# EAGLE design usb2classic (EAGLE 6.6.0)
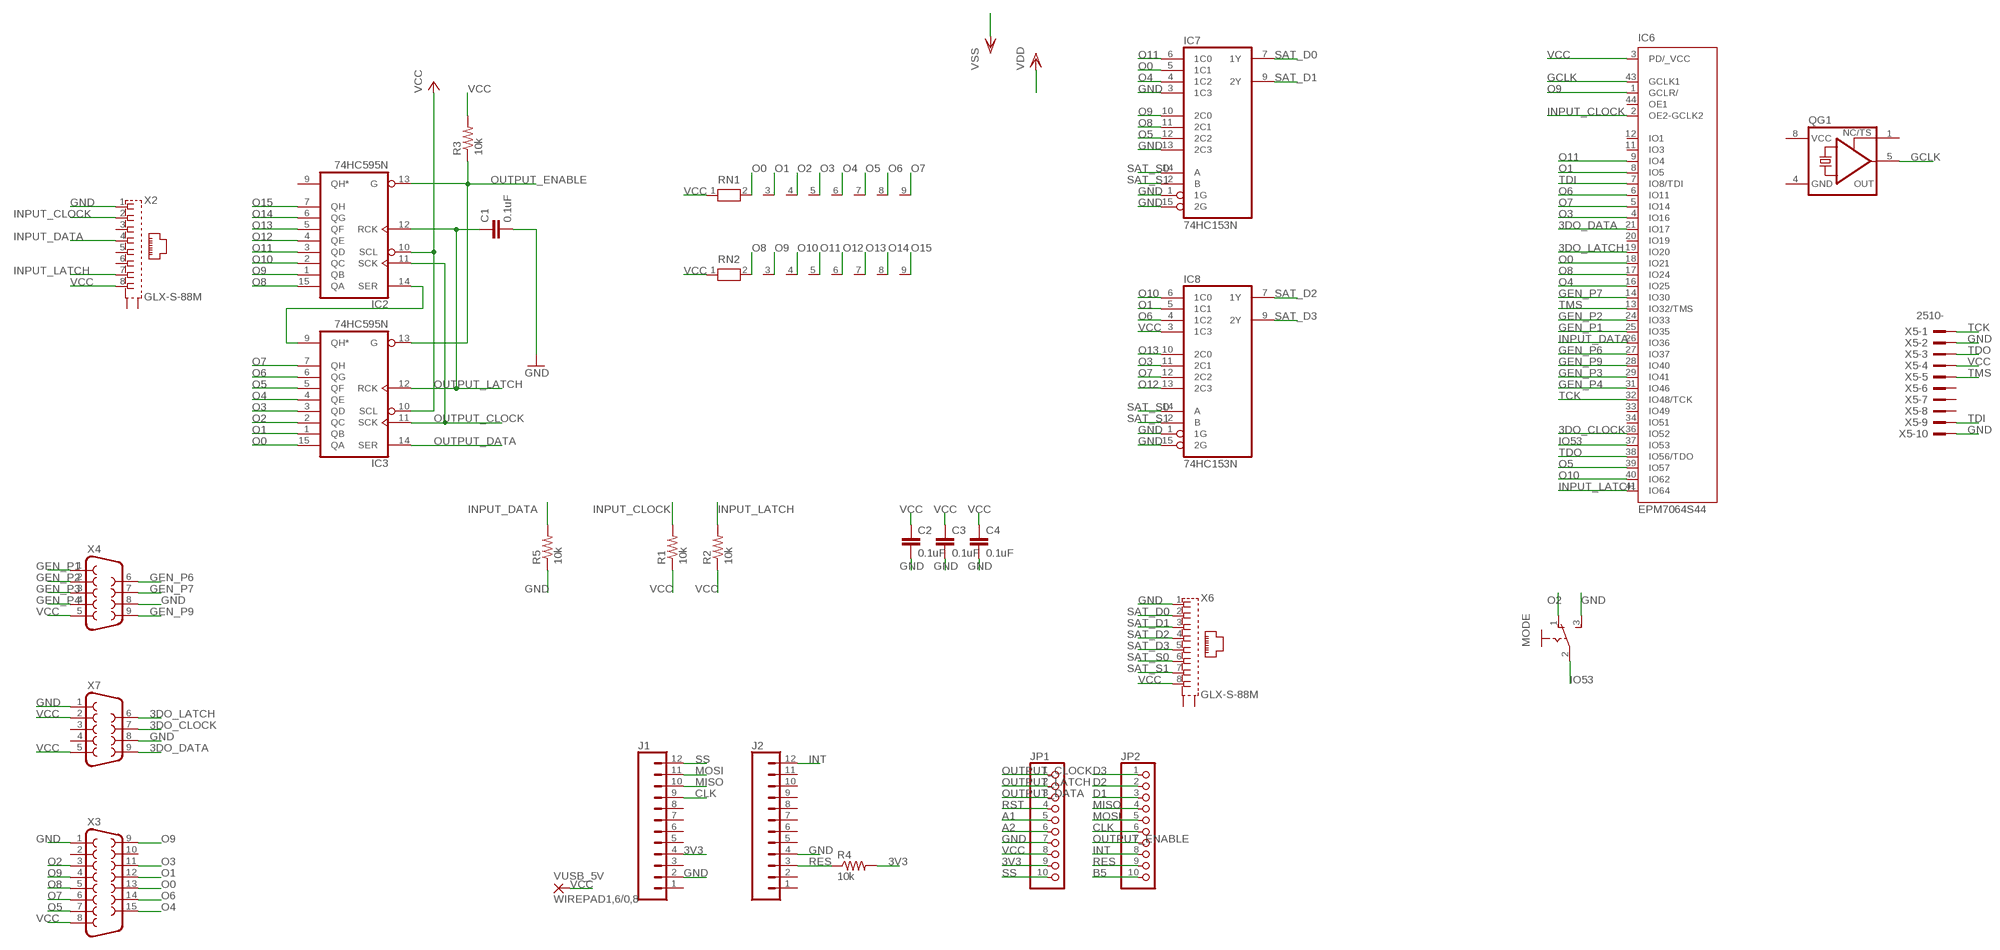
[diagram p0: schematic, sheet 1]

## Parts
C1  0.1uF  C-EU050-024X044  [C050-024X044]
C2  0.1uF  C-EU050-024X044  [C050-024X044]
C3  0.1uF  C-EU050-024X044  [C050-024X044]
C4  0.1uF  C-EU050-024X044  [C050-024X044]
IC2  74HC595N  [DIL16]
IC3  74HC595N  [DIL16]
IC6  EPM7064S44  [PLCC-S44]
IC7  74HC153N  [DIL16]
IC8  74HC153N  [DIL16]
J1  CONN_12  [1X12]
J2  CONN_12  [1X12]
JP1  PINHD-1X10  [1X10]
JP2  PINHD-1X10  [1X10]
MODE  CHAVE  [CHAVE]
QG1  XO-8  [DIL08S]
R1  10k  R-US_0207/10  [0207/10]
R2  10k  R-US_0207/10  [0207/10]
R3  10k  R-US_0207/10  [0207/10]
R4  10k  R-US_0207/10  [0207/10]
R5  10k  R-US_0207/10  [0207/10]
RN1  RN08  [RN-9]
RN2  RN08  [RN-9]
VUSB_5V  WIREPAD1,6/0,8  [1,6/0,8]
X2  GLX-S-88M  [GLX-S-88M]
X3  F15HP  [F15HP]
X4  F09HP  [F09HP]
X5  2510-  [PAK100/2500-10]
X6  GLX-S-88M  [GLX-S-88M]
X7  F09HP  [F09HP]

## Nets
3DO_CLOCK: IC6.36(IO52) X7.7
3DO_DATA: IC6.21(IO17) X7.9
3DO_LATCH: IC6.19(IO20) X7.6
3V3: J1.4 JP1.9 R4.2
A1: JP1.5
A2: JP1.6
B5: JP2.10
CLK: J1.9 JP2.6
D1: JP2.3
D2: JP2.2
D3: JP2.1
GCLK: IC6.43(GCLK1) QG1.5(OUT)
GEN_P1: IC6.25(IO35) X4.1
GEN_P2: IC6.24(IO33) X4.2
GEN_P3: IC6.29(IO41) X4.3
GEN_P4: IC6.31(IO46) X4.4
GEN_P6: IC6.27(IO37) X4.6
GEN_P7: IC6.14(IO30) X4.7
GEN_P9: IC6.28(IO40) X4.9
GND: C1.2 C2.2 C3.2 C4.2 IC7.1(1G) IC7.3(1C3) IC7.13(2C3) IC7.15(2G) IC8.1(1G) IC8.15(2G) J1.2 J2.4 JP1.7 MODE.3(S) R5.1 X2.1 X3.1 X4.8 X5.2 X5.10 X6.1 X7.1 X7.8 ; supply symbol labelled VSS
INPUT_CLOCK: IC6.2(OE2-GCLK2) R1.2 X2.2
INPUT_DATA: IC6.26(IO36) R5.2 X2.4
INPUT_LATCH: IC6.41(IO64) R2.2 X2.7
INT: J2.12 JP2.8
IO53: IC6.37(IO53) MODE.2(P)
MISO: J1.10 JP2.4
MOSI: J1.11 JP2.5
N$1: IC2.14(SER) IC3.9(QH*)
O0: IC3.15(QA) IC6.18(IO21) IC7.5(1C1) RN1.2 X3.13
O1: IC3.1(QB) IC6.8(IO5) IC8.5(1C1) RN1.3 X3.12
O2: IC3.2(QC) MODE.1(O) RN1.4 X3.3
O3: IC3.3(QD) IC6.4(IO16) IC8.11(2C1) RN1.5 X3.11
O4: IC3.4(QE) IC6.16(IO25) IC7.4(1C2) RN1.6 X3.15
O5: IC3.5(QF) IC6.39(IO57) IC7.12(2C2) RN1.7 X3.7
O6: IC3.6(QG) IC6.6(IO11) IC8.4(1C2) RN1.8 X3.14
O7: IC3.7(QH) IC6.5(IO14) IC8.12(2C2) RN1.9 X3.6
O8: IC2.15(QA) IC6.17(IO24) IC7.11(2C1) RN2.2 X3.5
O9: IC2.1(QB) IC6.1(GCLR/) IC7.10(2C0) RN2.3 X3.4 X3.9
O10: IC2.2(QC) IC6.40(IO62) IC8.6(1C0) RN2.4
O11: IC2.3(QD) IC6.9(IO4) IC7.6(1C0) RN2.5
O12: IC2.4(QE) IC8.13(2C3) RN2.6
O13: IC2.5(QF) IC8.10(2C0) RN2.7
O14: IC2.6(QG) RN2.8
O15: IC2.7(QH) RN2.9
OUTPUT_CLOCK: IC2.11(SCK) IC3.11(SCK) JP1.1
OUTPUT_DATA: IC3.14(SER) JP1.3
OUTPUT_ENABLE: IC2.13(G) IC3.13(G) JP2.7 R3.1
OUTPUT_LATCH: C1.1 IC2.12(RCK) IC3.12(RCK) JP1.2
RES: J2.3 JP2.9 R4.1
RST: JP1.4
SAT_D0: IC7.7(1Y) X6.2
SAT_D1: IC7.9(2Y) X6.3
SAT_D2: IC8.7(1Y) X6.4
SAT_D3: IC8.9(2Y) X6.5
SAT_S0: IC7.14(A) IC8.14(A) X6.6
SAT_S1: IC7.2(B) IC8.2(B) X6.7
SS: J1.12 JP1.10
TCK: IC6.32(IO48/TCK) X5.1
TDI: IC6.7(IO8/TDI) X5.9
TDO: IC6.38(IO56/TDO) X5.3
TMS: IC6.13(IO32/TMS) X5.5
VCC: C2.1 C3.1 C4.1 IC2.10(SCL) IC3.10(SCL) IC6.3(PD/_VCC) IC8.3(1C3) JP1.8 R1.1 R2.1 R3.2 RN1.1 RN2.1 VUSB_5V.1(P) X2.8 X3.8 X4.5 X5.4 X6.8 X7.2 X7.5 ; supply symbol labelled VDD
Unconnected: IC2.9(QH*) IC6.11(IO3) IC6.12(IO1) IC6.20(IO19) IC6.33(IO49) IC6.34(IO51) IC6.44(OE1) J1.1 J1.3 J1.5 J1.6 J1.7 J1.8 J2.1 J2.2 J2.5 J2.6 J2.7 J2.8 J2.9 J2.10 J2.11 QG1.1(TS) X2.3 X2.5 X2.6 X2.S1 X2.S2 X3.2 X3.10 X5.6 X5.7 X5.8 X6.S1 X6.S2 X7.3 X7.4

## Power pins joined to a net without a drawn wire
GND: IC2.8(GND) IC3.8(GND) IC6.10(GND) IC6.22(GND) IC6.30(GND) IC6.42(GND) IC7.8(GND) IC8.8(GND) QG1.4(GND)
VCC: IC2.16(VCC) IC3.16(VCC) IC6.15(VCC) IC6.23(VCC) IC6.35(VCC) IC7.16(VCC) IC8.16(VCC) QG1.8(VCC)

## Library data of the parts
C1-C4 = rcl:C-EU: CAPACITOR, European symbol
IC2 IC3 = 74xx-eu:74*595: 8-bit SHIFT REGISTER, output latch
IC6 = altera:EPM7064: EPM7064 MAX 7000 family; MPN: EPM7064SLC44-10N; OC_FARNELL: 1549449; OC_NEWARK: 51R0526
IC7 IC8 = 74xx-eu:74*153: Dual 4-line to 1-line data SELECTOR/MULTIPLEXER
J1 J2 = SparkFun-Connectors:CONN_12: Multi connection point. Often used as Generic Header-pin footprint for 0.1 inch spaced/style header connections On any of the 0.1 inch spaced packages, you can populate with these: Break Away Headers - Straight <https://www.sparkfun.com/products/116> (PRT-00116) Break Away Male Headers - Right Angle <https://www.sparkfun.com/products/553> (PRT-00553) Female Headers <https://www.sparkfun.com/products/115> (PRT-00115) Break Away Headers - Machine Pin <https://www.sparkfun.com/products/117> (PRT-00117) Break Away Female Headers - Swiss Machine Pin <https://www.sparkfun.com/products/743> (PRT-00743) For SCREWTERMINALS and SPRING TERMINALS visit here: Screw Terimnals on SparkFun.com <https://www.sparkfun.com/search/results?term=Screw+Terminals> (5mm/3.5mm/2.54mm spacing) This device is also useful as a general connection point to wire up your design to another part of your project. Our various solder wires solder well into these plated through hole pads. Hook-Up Wire - Assortment (Stranded, 22 AWG) <https://www.sparkfun.com/products/11375> (PRT-11375) Hook-Up Wire - Assortment (Solid Core, 22 AWG) <https://www.sparkfun.com/products/11367> (PRT-11367) View the entire wire category on our website here <https://www.sparkfun.com/categories/141> Special notes: Molex polarized connector foot print use with SKU : PRT-08231 with associated crimp pins and housings. 1MM SMD Version SKU: PRT-10208 NOTES ON THE VARIANTS LOCK and LOCK_LONGPADS... This footprint was designed to help hold the alignment of a through-hole component (i.e. 6-pin header) while soldering it into place. You may notice that each hole has been shifted either up or down by 0.005 of an inch from it's more standard position (which is a perfectly straight line). This slight alteration caused the pins (the squares in the middle) to touch the edges of the holes. Because they are alternating, it causes a "brace" to hold the component in place. 0.005 has proven to be the perfect amount of "off-center" position when using our standard breakaway headers. Although looks a little odd when you look at the bare footprint, once you have a header in there, the alteration is very hard to notice. Also,if you push a header all the way into place, it is covered up entirely on the bottom side.
JP1 JP2 = pinhead:PINHD-1X10: PIN HEADER
MODE = switch-fef:CHAVE: chave Verificar
QG1 = crystal:XO-: CRYSTAL; OC_FARNELL: unknown; OC_NEWARK: unknown
R1-R5 = resistor:R-US_: RESISTOR, American symbol
RN1 RN2 = resistor-net:RN08: RESISTOR NETWORK; OC_FARNELL: unknown; OC_NEWARK: unknown
VUSB_5V = wirepad:WIREPAD: Wire PAD connect wire on PCB
X2 X6 = con-kycon:GLX-S-88M: Mod. Jack, Right Angle, 8 posiotion, 8 contatcs RJ45 Source: GLX-S-88M.pdf; OC_FARNELL: unknown; OC_NEWARK: unknown
X3 = con-subd:F15: SUB-D; OC_FARNELL: unknown; OC_NEWARK: unknown
X4 X7 = con-subd:F09: SUB-D; OC_FARNELL: unknown; OC_NEWARK: unknown
X5 = con-3m:2510-: 3M (TM) Pak 100 4-Wall Header Source: 3M; MF: 3M; MPN: 2510-6002UB; OC_FARNELL: 9838244; OC_NEWARK: 46F4725

## Board
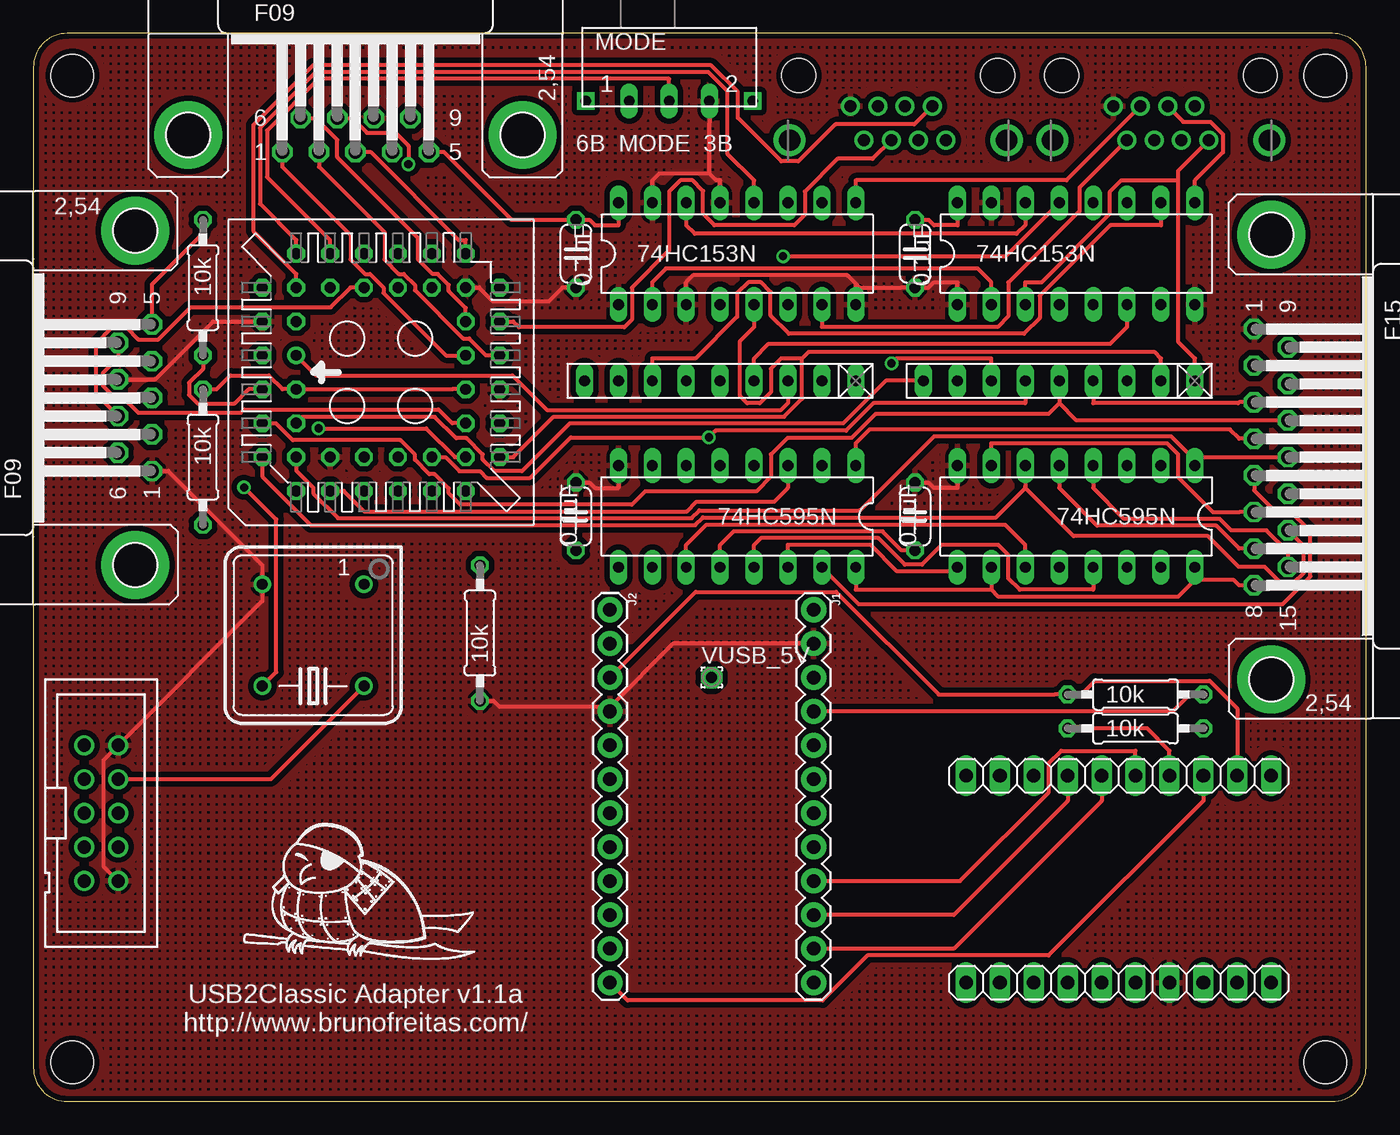
[diagram p1: board, top side]
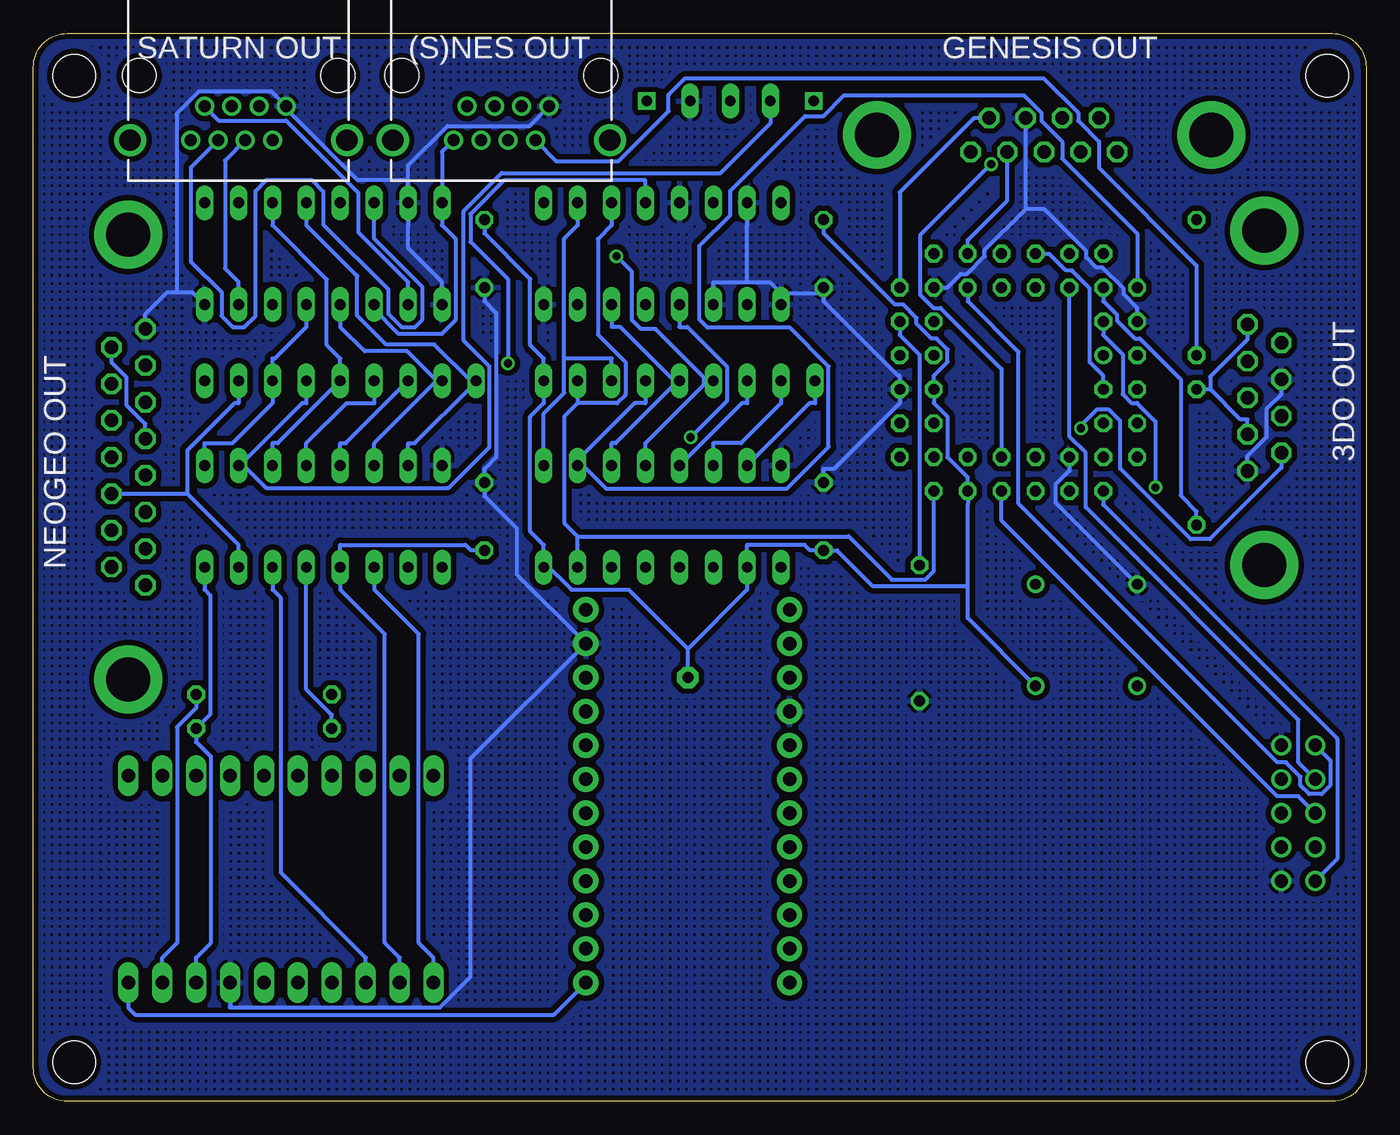
[diagram p2: board, bottom side, seen from below]

Size 99.82 x 80 mm. Coordinates in mm from the lower left corner, seen from the top.
Outline: 2.54,0 97.28,0 arc90 99.82,2.54 99.82,77.46 arc90 97.28,80 2.54,80 arc90 0,77.46 0,2.54 arc90 2.54,0
Copper layers (1*16): Top 0.035mm / dielectric 1.5mm / Bottom 0.035mm
Design rules "SeeedStudio_2layer_DRU_no_angle_20140221": minimum track width 6mil, minimum drill 12mil, track to track 6mil, track to pad 6mil, pad to pad 6mil, via to via 6mil, smd to smd 0mil, copper to edge 10mil, drill to drill 10mil, minimum pad ring 10mil, minimum via ring 6mil, stop-mask expansion 2mil, vias tented up to drill 100mil, thermal gap 10mil
Holes 3.2 mm at 2.92,2.92 96.77,2.92 2.92,76.83 96.77,76.83

### Footprints (pad centres in the part's own frame; a part is rotated, then mirrored left to right if it is on the bottom)
C050-024X044 = drill 0.813 octagon: 1 -2.54,0; 2 2.54,0
DIL16 = drill 0.813 long: 1 -8.89,-3.81; 2 -6.35,-3.81; 3 -3.81,-3.81; 4 -1.27,-3.81; 5 1.27,-3.81; 6 3.81,-3.81; 7 6.35,-3.81; 8 8.89,-3.81; 9 8.89,3.81; 10 6.35,3.81; 11 3.81,3.81; 12 1.27,3.81; 13 -1.27,3.81; 14 -3.81,3.81; 15 -6.35,3.81; 16 -8.89,3.81
PLCC-S44 = drill 0.813: 1 1.27,6.35 | drill 0.813 octagon: 2 -1.27,8.89; 3 -1.27,6.35; 4 -3.81,8.89; 5 -3.81,6.35; 6 -6.35,8.89; 7 -8.89,6.35; 8 -6.35,6.35; 9 -8.89,3.81; 10 -6.35,3.81; 11 -8.89,1.27; 12 -6.35,1.27; 13 -8.89,-1.27; 14 -6.35,-1.27; 15 -8.89,-3.81; 16 -6.35,-3.81; 17 -8.89,-6.35; 18 -6.35,-8.89; 19 -6.35,-6.35; 20 -3.81,-8.89; 21 -3.81,-6.35; 22 -1.27,-8.89; 23 -1.27,-6.35; 24 1.27,-8.89; 25 1.27,-6.35; 26 3.81,-8.89; 27 3.81,-6.35; 28 6.35,-8.89; 29 8.89,-6.35; 30 6.35,-6.35; 31 8.89,-3.81; 32 6.35,-3.81; 33 8.89,-1.27; 34 6.35,-1.27; 35 8.89,1.27; 36 6.35,1.27; 37 8.89,3.81; 38 6.35,3.81; 39 8.89,6.35; 40 6.35,8.89; 41 6.35,6.35; 42 3.81,8.89; 43 3.81,6.35; 44 1.27,8.89
1X12 = drill 1.016 pad 1.88: 1 0,0; 2 2.54,0; 3 5.08,0; 4 7.62,0; 5 10.16,0; 6 12.7,0; 7 15.24,0; 8 17.78,0; 9 20.32,0; 10 22.86,0; 11 25.4,0; 12 27.94,0
1X10 = drill 1.016 long: 1 -11.43,0; 2 -8.89,0; 3 -6.35,0; 4 -3.81,0; 5 -1.27,0; 6 1.27,0; 7 3.81,0; 8 6.35,0; 9 8.89,0; 10 11.43,0
CHAVE = drill 0.8 long: 1 -3,0; 2 0,0; 3 3,0 | drill 0.8 square: P$1 -6.25,0; P$2 6.25,0
DIL08S = drill 0.813: 1 -3.81,-3.81; 4 3.81,-3.81; 5 3.81,3.81; 8 -3.81,3.81
0207/10 = drill 0.813 octagon: 1 -5.08,0; 2 5.08,0
RN-9 = drill 0.813 long: 1 -10.16,0; 2 -7.62,0; 3 -5.08,0; 4 -2.54,0; 5 0,0; 6 2.54,0; 7 5.08,0; 8 7.62,0; 9 10.16,0
1,6/0,8 = drill 0.813 pad 1.6 octagon: 1 0,0
GLX-S-88M = drill 0.9 pad 1.422: 1 -3.57,-2.3; 2 -2.55,-4.84; 3 -1.53,-2.3; 4 -0.51,-4.84; 5 0.51,-2.3; 6 1.53,-4.84; 7 2.55,-2.3; 8 3.57,-4.84 | drill 1.6 pad 2.184: S1 -8.125,-4.84; S2 8.125,-4.84 | hole 2.55: -7.44,0; 7.44,0
F15HP = drill 1.016 octagon: 1 -9.601,-1.27; 2 -6.858,-1.27; 3 -4.115,-1.27; 4 -1.372,-1.27; 5 1.372,-1.27; 6 4.115,-1.27; 7 6.858,-1.27; 8 9.601,-1.27; 9 -8.23,1.27; 10 -5.486,1.27; 11 -2.743,1.27; 12 0,1.27; 13 2.743,1.27; 14 5.486,1.27; 15 8.23,1.27 | drill 3.302 pad 5.08: G1 -16.662,0; G2 16.662,0
F09HP = drill 1.016 octagon: 1 -5.486,-1.27; 2 -2.743,-1.27; 3 0,-1.27; 4 2.743,-1.27; 5 5.486,-1.27; 6 -4.115,1.27; 7 -1.372,1.27; 8 1.372,1.27; 9 4.115,1.27 | drill 3.302 pad 5.08: G1 -12.522,0; G2 12.522,0
PAK100/2500-10 = drill 1 pad 1.422: 1 -5.08,-1.27; 2 -5.08,1.27; 3 -2.54,-1.27; 4 -2.54,1.27; 5 0,-1.27; 6 0,1.27; 7 2.54,-1.27; 8 2.54,1.27; 9 5.08,-1.27; 10 5.08,1.27

### Placement (x,y rotation side)
C1  66.04,43.81 90 top
C2  40.64,43.81 90 top
C3  40.64,63.5 270 top
C4  66.04,63.5 270 top
IC2  52.7,43.81 180 top
IC3  78.11,43.81 180 top
IC6  26.04,54.61 90 top
IC7  52.7,63.5 0 top
IC8  78.11,63.5 0 top
J1  58.44,36.83 270 top
J2  43.18,36.83 270 top
JP1  81.28,8.89 0 top
JP2  81.28,24.39 0 top
MODE  47.62,74.93 0 top
QG1  20.95,34.92 180 top
R1  12.7,60.96 270 top
R2  12.7,48.26 270 top
R3  82.55,27.94 0 top
R4  82.55,30.48 0 top
R5  33.45,35.08 90 top
RN1  76.83,53.98 180 top
RN2  51.44,53.98 180 top
VUSB_5V  50.8,31.75 0 top
X2  64.77,76.83 0 top
X3  92.71,48.26 270 top
X4  24.13,72.39 0 top
X5  5.08,21.59 270 top
X6  84.45,76.83 0 top
X7  7.62,52.7 90 top

### Tracks (layer width: path | path; a pad name or v marks a point on that pad's centre or on a via)
3DO_CLOCK
  Top 0.305: IC6.36 23.75,60.96 22.28,59.49 11.78,59.49 9.36,57.07 7.85,57.07 6.94,57.99 5.9,57.99 4.69,56.78 4.69,52.99 X7.7
3DO_DATA
  Top 0.305: IC6.21 31.37,50.8 30.34,51.83 15.79,51.83 15.54,51.58 7.86,51.58 6.56,52.88 5.93,52.88 5.2,53.61 5.2,54.55 6.35,55.7 X7.9
3DO_LATCH  (via drill 0.61 pad 1.02)
  Top 0.305: v21.36,50.41 29.43,50.41 31.58,48.26 IC6.19
  Bottom 0.305: v21.36,50.41 21.36,50.63 20.18,51.82 19.26,51.82 18.41,50.98 18.41,47.4 13.14,42.12 11.7,42.12 6.35,47.47 X7.6
3V3
  Top 0.305: R4.2 86.61,30.48 85.34,29.21 J1.4
  Bottom 0.305: JP1.9 90.17,10.77 89.05,11.89 89.05,28.04 87.63,29.46 R4.2
CLK
  Top 0.305: JP2.6 82.55,26.27 76.98,26.27 76.05,25.34 76.05,23.16 69.4,16.51 J1.9
GCLK  (via drill 0.61 pad 1.02)
  Top 0.305: QG1.5 18.18,32.15 18.18,43.59 v15.78,45.99
  Bottom 0.305: v15.78,45.99 15.78,50.94 17.16,52.32 17.59,52.32 18.23,52.97 18.23,55.95 19.68,57.4 IC6.43
GEN_P1
  Top 0.305: X4.1 18.64,70 23.75,64.9 23.75,63.06 24.83,61.98 25.21,61.98 26.22,60.97 26.22,60.56 30.9,55.88 IC6.25
GEN_P2
  Top 0.305: X4.2 21.39,70 26.29,65.1 26.29,63.06 27.37,61.98 27.75,61.98 28.57,61.15 28.57,60.77 32.19,57.15 32.64,57.15 33.91,55.88 IC6.24
GEN_P3
  Top 0.305: IC6.29 32.38,64.52 31.85,64.52 25.25,71.12 X4.3
GEN_P4
  Bottom 0.305: X4.4 26.87,67.49 29.84,64.52 IC6.31
GEN_P6
  Top 0.305: IC6.27 32.38,59.44 31.11,60.71 31.11,61.15 30.29,61.98 29.91,61.98 28.83,63.06 28.83,64.67 22.76,70.74 22.76,72.03 21.13,73.66 X4.6
GEN_P7  (via drill 0.61 pad 1.02)
  Top 0.305: v28.09,70.2 28.09,71.57 27.11,72.54 24.99,72.54 23.88,73.66 X4.7
  Bottom 0.305: v28.09,70.2 33.41,64.87 33.41,60.44 32.42,59.44 31.88,59.44 27.3,54.86 IC6.14
GEN_P9
  Bottom 0.305: X4.9 29.36,73.66 34.92,68.1 IC6.28
GND
  Top 0.305: X7.1 10.1,47.22 17.14,40.17 QG1.4 17.14,37.47 X5.2 5.24,25.56 5.24,17.62 X5.10 | 43.18,29.56 34.9,29.56 34.47,30 R5.1 | J1.2 47.91,34.29 43.18,29.56 | 43.18,29.56 J2.4 | X7.8 9.12,54.08 13.46,58.42 IC6.42 | 61.59,61.24 60.96,61.88 49.4,61.88 48.9,61.37 IC7.3 | 50.62,69.5 46.86,69.5 46.35,68.99 IC7.15 | 50.62,69.5 50.62,73.27 MODE.3 | 50.62,69.5 51.13,68.99 51.44,68.99 IC7.13 | 61.59,61.24 61.87,60.96 65.02,60.96 C4.2 67.06,60.96 67.46,61.37 69.22,61.37 IC8.1 | C2.2 41.66,46.35 42.06,45.95 43.81,45.95 IC2.8 | IC7.8 61.59,61.24 | C1.2 67.06,46.35 67.46,45.95 69.22,45.95 IC3.8 | C3.2 39.62,60.96 38.59,59.92 34.44,59.92 33.4,60.96 IC6.30
  Bottom 0.305: C4.2 66.04,59.94 65.15,59.05 65.15,48.26 66.04,47.37 C1.2 66.04,45.34 63.59,42.89 63.59,39.44 J1.2 67.1,25.63 67.1,9.3 69.39,7.01 85.09,7.01 JP1.7 | IC6.30 31.37,60.96 30.35,61.98 29.91,61.98 28.57,63.31 28.57,63.76 25.5,66.83 | 25.5,66.83 X4.8 | 25.5,66.83 24.11,66.83 20.95,63.68 20.95,63.23 20.19,62.47 19.75,62.47 18.16,60.88 18.16,60.45 17.14,59.44 IC6.42 | 89.1,60.6 87.91,60.6 IC8.8 | 89.1,60.6 89.81,60.6 91.44,58.98 X3.1 | 89.1,60.6 89.1,73.97 87.43,75.64 81.99,75.64 X6.1 80.89,74.35 75.52,68.99 71.75,68.99 | QG1.4 23.24,44.83 23.24,46.23 22.23,47.24 IC6.10 | X7.1 8.89,48.34 7.47,49.76 7.47,51.84 6.35,52.96 X7.8 | 46.35,61.37 44.65,61.37 43.81,60.53 | 46.35,61.37 48.9,61.37 IC7.3 | 46.35,61.37 46.35,65.63 IC7.15 | IC7.1 43.81,60.53 | 40.64,60.53 40.64,59.94 35.05,54.36 34.92,54.36 IC6.22 34.92,52.32 39.88,47.37 40.64,47.37 C2.2 | C3.2 40.64,60.53 | 43.81,60.53 40.64,60.53 | 71.75,68.99 71.75,70.11 68.81,73.06 62.67,73.06 X2.1 | 71.75,68.99 IC8.15 71.75,65.63 71.75,63.91 69.22,61.37 IC8.1
  pour Bottom (isolate 0.406, hatched): 0,80.29 99.87,80.29 99.87,0 0,0
  pour Top (isolate 0.406, hatched): 0,80.11 99.69,80.11 99.69,0 0,0
INPUT_CLOCK
  Top 0.305: IC6.2 16.13,53.34 15.07,52.28 12.3,52.28 11.66,52.92 11.66,53.83 12.7,54.86 R1.2
  Bottom 0.305: X2.2 60.66,70.44 56,70.44 52.25,74.18 52.25,75.39 51,76.64 24.16,76.64 21.57,74.05 21.57,73.45 20.02,71.9 20.02,69.93 12.7,62.61 R1.2
INPUT_DATA
  Top 0.305: X2.4 62.86,70.6 60.23,70.6 57.78,68.15 57.78,66.42 57,65.63 51.01,65.63 50.16,66.48 50.16,68.19 49.37,68.99 48.47,68.99 47.62,68.14 47.62,63.75 44.83,60.95 44.83,58.55 44.27,57.99 36.37,57.99 35.94,58.42 IC6.26
  Bottom 0.305: IC6.26 34.92,57.4 33.45,55.93 R5.2
INPUT_LATCH
  Top 0.305: X2.7 65.98,73.19 60.08,73.19 57.3,70.42 56.02,70.42 52.76,73.68 52.76,75.61 50.76,77.61 20.94,77.61 16.46,73.14 16.46,65.2 19.68,61.98 IC6.41
  Bottom 0.305: R2.2 12.7,44.2 13.89,45.38 13.89,54.08 16.96,57.15 17.33,57.15 18.67,58.49 18.67,58.93 19.68,59.94 IC6.41
INT
  Top 0.305: JP2.8 87.63,22.51 76.04,10.92 62.46,10.92 59.1,7.57 44.51,7.57 J2.12
IO53
  Top 0.305: IC6.37 22.23,64.52 17.49,69.25 17.49,72.72 21.36,76.59 47.62,76.59 MODE.2
MISO
  Top 0.305: JP2.4 77.47,22.51 68.93,13.97 J1.10
MOSI
  Top 0.305: J1.11 68.93,11.43 80.01,22.51 JP2.5
N$1
  Top 0.305: IC2.14 56.52,41.68 62.72,41.68 64.69,39.71 68.92,39.71 IC3.9
O0
  Top 0.305: 57.58,55.65 58.09,56.16 83.95,56.16 84.45,55.65 RN1.2 | IC7.5 53.98,58.01 52.93,56.97 52.93,52.84 53.47,52.3 54.41,52.3 55.24,53.13 55.24,54.89 56.01,55.65 57.58,55.65 | 57.58,55.65 57.58,52.63 56.24,51.28 38.96,51.28 35.94,48.26 IC6.18
  Bottom 0.305: RN1.2 84.45,52.3 84.76,52.3 88.29,48.77 88.29,45.52 | 88.29,45.52 84.45,41.68 IC3.15 | X3.13 88.29,45.52
O1
  Top 0.305: 87,48.03 85.2,49.83 67.47,49.83 61.91,44.26 49.89,44.26 49.31,43.68 22.82,43.68 20.95,45.55 20.95,45.97 19.68,47.24 IC6.8 | 87,48.03 87.22,48.26 X3.12 | IC3.1 87,48.03
  Bottom 0.305: IC8.5 79.38,58.01 81.74,55.65 81.92,55.65 RN1.3 81.92,52.3 84.91,49.3 87,49.3 IC3.1
O2
  Top 0.305: RN1.4 79.38,52.3 90.25,52.3 90.32,52.38 X3.3
  Bottom 0.305: 84.2,47.77 82.38,45.95 68.72,45.95 65.66,49.01 65.66,55.06 67.59,56.99 67.59,66.68 64.74,69.53 48.36,69.53 44.62,73.27 MODE.1 | IC3.2 84.31,47.77 84.2,47.77 | 84.2,47.77 79.68,52.3 79.38,52.3 RN1.4
O3
  Top 0.305: 76.83,52.3 76.03,51.49 63.07,51.49 61.27,49.7 56.49,49.7 55.24,48.46 55.24,46.8 54.14,45.69 45.83,45.69 44.84,44.7 31.96,44.7 31.11,45.55 31.11,45.92 30.05,46.99 29.66,46.99 28.57,48.07 28.57,48.45 27.49,49.53 19.43,49.53 18.16,50.8 IC6.4 | X3.11 78.13,51 76.83,52.3 | RN1.5 76.83,52.3
  Bottom 0.305: IC3.3 81.92,49.3 81.51,49.3 RN1.5 76.83,54.23 76.83,55.65 77.85,56.67 77.85,61.57 81.92,65.63 IC8.11
O4  (via drill 0.61 pad 1.02)
  Top 0.305: IC3.4 79.38,45.95 81.69,43.64 88.85,43.64 89.71,42.77 92.36,42.77 93.98,41.15 X3.15 | RN1.6 74.3,52.3 62.91,52.3 60.86,50.25 51.1,50.25 v50.6,49.74 40.25,49.74 37.21,46.7 33.95,46.7 33.44,47.21 31.91,47.21 30.86,48.26 IC6.16
  Bottom 0.305: RN1.6 74.3,52.3 76.38,52.3 79.38,49.3 IC3.4 | IC7.4 51.44,58.01 50.83,58.01 47.88,55.06 47.88,52.46 v50.6,49.74
O5  (via drill 0.61 pad 1.02)
  Top 0.305: v64.28,55.28 64.65,55.65 71.75,55.65 RN1.7 | IC3.5 76.83,45.95 79.65,43.13 88.59,43.13 90.32,41.4 X3.7 | IC6.39 19.68,64.52 16.97,67.23 16.97,72.92 21.15,77.1 50.55,77.1 52,75.66 52,70.97 53.98,68.99 IC7.12
  Bottom 0.305: IC3.5 76.83,49.3 76.43,49.3 RN1.7 | v64.28,55.28 64.28,61.59 67.08,64.4 67.08,66.47 64.57,68.99 53.98,68.99 IC7.12
O6
  Top 0.305: IC6.6 17.14,46.81 20.78,43.17 49.56,43.17 50.14,43.75 72.1,43.75 74.3,45.95 | 74.3,45.95 74.3,46.08 IC3.6 | X3.14 95.12,41.63 95.12,39.56 94.42,38.86 93.4,38.86 92.22,40.03 90.28,40.03 87.97,42.33 77.91,42.33 74.3,45.95
  Bottom 0.305: 69.62,53.98 71.83,56.19 75.01,56.19 76.83,58.01 IC8.4 | 69.62,53.98 74.3,49.3 IC3.6 | RN1.8 69.62,53.98
O7
  Top 0.305: RN1.9 63.84,53.98 60.64,50.77 40.16,50.77 36.6,47.21 34.54,47.21 33.66,48.09 33.66,48.46 32.44,49.67 31.66,49.67 30.06,51.28 20.16,51.28 IC6.5 | IC3.7 71.75,49.3 84.9,49.3 85.72,48.48 85.72,46.77 88.35,44.15 90.32,44.15 X3.6
  Bottom 0.305: IC3.7 71.75,49.3 71.25,49.3 66.98,53.57 | 66.98,53.57 66.98,53.88 69.8,56.7 73.41,56.7 75.56,58.85 75.56,61.82 79.38,65.63 IC8.12 | 66.98,53.57 66.67,53.57 RN1.9
O8
  Top 0.305: IC2.15 61.81,37.25 93.57,37.25 95.64,39.33 95.64,42.71 94.04,44.31 92.9,44.31 91.44,45.77 X3.5
  Bottom 0.305: 59.05,52.3 60.07,51.28 60.07,43.33 59.05,42.32 | RN2.2 59.05,52.3 | 59.05,52.3 56.09,52.3 55.47,52.92 55.47,55.38 57.55,57.45 57.55,64.6 56.52,65.63 IC7.11 | 59.05,42.32 38.75,42.32 35.52,39.09 33.02,39.09 32.38,39.73 IC6.17 | 59.05,42.32 59.05,41.68 IC2.15
O9
  Top 0.305: IC2.1 61.59,49.3 62.63,50.33 89.62,50.33 90.32,49.63 X3.4 | IC6.1 21.19,54.38 35.88,54.38 38.47,51.79 56.01,51.79 56.52,52.3 RN2.3
  Bottom 0.305: 60.07,55.65 60.07,64.62 59.05,65.63 IC7.10 | IC2.1 61.59,51.54 60.07,53.06 60.07,55.65 | 60.07,55.65 | 60.07,55.65 56.52,55.65 RN2.3 | X3.4 91.44,50.75 92.86,52.17 92.86,54.25 93.98,55.37 X3.9
O10
  Top 0.305: IC8.6 81.92,58.01 80.65,56.75 55.07,56.75 53.98,55.65 RN2.4
  Bottom 0.305: RN2.4 53.98,52.3 54.78,52.3 59.05,48.03 | 59.05,48.03 56.92,45.89 43.39,45.89 40.26,49.02 40.26,55.06 43.16,57.96 49.33,57.96 49.93,58.56 49.93,64.09 47.62,66.4 47.62,68.2 42.02,73.81 40.66,73.81 39.11,75.36 25.62,75.36 24.31,74.05 24.31,73.45 22.76,71.9 22.76,70.62 17.14,65.01 IC6.40 | IC2.2 59.05,48.03
O11
  Top 0.305: IC6.9 23.24,45.72 24.77,44.2 48.95,44.2 49.68,44.93 55.5,44.93 56.52,45.95 IC2.3
  Bottom 0.305: 51.68,53.83 55.86,58.01 56.52,58.01 IC7.6 | 51.68,53.83 56.21,49.3 56.52,49.3 IC2.3 | 51.68,53.83 51.58,53.83 RN2.5
O12  (via drill 0.61 pad 1.02)
  Top 0.305: v56.15,63.3 72.83,63.3 IC8.13
  Bottom 0.305: 49.59,53.69 53.98,49.3 IC2.4 | 49.59,53.69 49.05,53.69 48.9,53.53 RN2.6 | 49.59,53.69 49.59,54.23 53.22,57.86 54.33,57.86 54.99,58.52 54.99,62.14 v56.15,63.3
O13
  Top 0.305: IC8.10 84.45,65.63 80.68,65.63 75.39,60.34 75.39,58.68 74.2,57.5 56.58,57.5 55.22,58.86 55.22,60.63 54.48,61.37 53.55,61.37 52.7,60.52 52.7,58.78 49.58,55.65 46.35,55.65 RN2.7
  Bottom 0.305: RN2.7 46.35,52.3 46.76,52.3 IC2.5
O14
  Bottom 0.305: IC2.6 48.9,49.3 46.81,49.3 43.81,52.3 RN2.8
O15
  Bottom 0.305: RN2.9 41.27,52.3 41.68,52.3 IC2.7
OUTPUT_CLOCK
  Top 0.305: IC3.11 74.3,41.68 72.77,43.21 50.42,43.21 48.9,41.68 IC2.11
  Bottom 0.305: IC3.11 74.3,38.33 70.97,35 70.97,11.89 69.85,10.77 JP1.1
OUTPUT_DATA
  Bottom 0.305: IC3.14 81.92,38.33 81.28,37.69 81.28,17.12 74.93,10.77 JP1.3
OUTPUT_ENABLE
  Top 0.305: IC2.13 53.98,41.68 54.48,42.19 63.29,42.19 65.26,40.22 66.56,40.22 68.02,41.68 72.26,41.68 73.03,40.92 73.03,39.18 73.87,38.33 79.38,38.33 IC3.13 | JP2.7 85.09,26.27 83.42,27.94 78.49,27.94 R3.1
  Bottom 0.305: R3.1 77.47,28.96 79.38,30.86 IC3.13
OUTPUT_LATCH
  Top 0.305: C1.1 65.02,41.27 63.6,42.7 52.45,42.7 51.44,41.68 IC2.12
  Bottom 0.305: JP1.2 72.39,10.77 73.51,11.89 73.51,35 76.83,38.33 IC3.12 76.83,41.68 67.46,41.68 67.06,41.27 C1.1
RES
  Top 0.305: J2.3 49.6,38.17 60.11,38.17 67.81,30.48 76.45,30.48 76.96,30.48 R4.1 78.49,30.48 79.5,31.5 88.11,31.5 90.17,29.44 JP2.9
SAT_D0
  Top 0.305: X6.2 78.36,68.45 78.36,66.67 73.03,61.34 73.03,58.81 72.22,58.01 59.05,58.01 IC7.7
SAT_D1
  Top 0.305: IC7.9 61.59,68.99 77.38,68.99 X6.3
SAT_D2
  Bottom 0.305: IC8.7 84.45,61.37 85.47,62.38 85.47,70.47 X6.4
SAT_D3
  Top 0.305: IC8.9 87,68.99 89.09,71.08 89.09,72.45 88.17,73.38 86.12,73.38 X6.5
SAT_S0
  Top 0.305: IC7.14 48.9,65.63 49.55,64.98 73.64,64.98 74.3,65.63 IC8.14
  Bottom 0.305: X6.6 88.03,69.95 88.03,62.9 85.72,60.6 85.72,58.83 84.88,57.99 84.03,57.99 83.19,58.84 83.19,68.19 82.36,69.03 78.98,69.03 78.11,68.15 78.11,65.68 73.25,60.83 73.25,59 72.24,57.99 71.25,57.99 70.68,58.56 70.68,61.01 74.3,64.62 IC8.14
SAT_S1
  Top 0.305: IC7.2 46.35,61.37 47.37,62.38 70.74,62.38 71.75,61.37 IC8.2
  Bottom 0.305: IC8.2 71.75,61.37 75.49,65.1 75.49,68.06 80.89,73.47 85.94,73.47 X6.7
SS
  Bottom 0.305: JP1.10 92.71,7.01 92.19,6.5 60.84,6.5 J1.12
TCK
  Bottom 0.305: IC6.32 29.84,59.94 26.04,56.13 26.04,44.78 6.66,25.4 6.01,25.4 4.92,24.31 4.92,23.67 4.27,23.02 3.33,23.02 2.67,23.68 2.67,25.53 X5.1
TDI
  Bottom 0.305: X5.9 2.16,18.16 2.16,27.18 19.68,44.7 IC6.7
TDO
  Bottom 0.305: X5.3 5.08,25.4 5.08,28.58 21,44.51 21,48.59 22.23,49.81 IC6.38
TMS
  Bottom 0.305: X5.5 5.08,22.86 6.66,22.86 27.3,43.5 IC6.13
VCC
  Top 0.305: 85.72,68.99 85.72,56.92 87,55.65 RN1.1 | X6.8 85.72,69.69 85.72,68.99 | 85.72,68.99 81.48,68.99 80.64,68.16 80.64,66.48 75.53,61.37 74.3,61.37 IC8.3 | 87,39.05 85.73,37.79 72.29,37.79 71.75,38.33 | 87,39.05 89.93,39.05 90.32,38.66 X3.8 | IC3.10 71.75,38.33 | IC2.16 61.59,38.33 71.75,38.33 | R2.1 13.72,53.34 14.75,54.37 17.64,54.37 18.67,53.34 IC6.3 20.7,53.34 31.37,53.34 IC6.23 | IC3.16 87,39.05 | QG1.8 17.78,24.13 X5.4 | IC7.16 43.81,65.63 42.06,65.63 41.66,66.04 C3.1 35.81,66.04 30.73,71.12 X4.5 | R1.1 12.7,65.02 8.89,61.21 X7.5 | C4.1 67.06,66.04 67.46,65.63 69.22,65.63 IC8.16
  Bottom 0.305: C4.1 66.04,65.02 62.61,61.59 62.61,56.67 61.59,55.65 RN2.1 61.59,53.97 61.59,52.3 62.61,51.28 62.61,42.7 61.59,41.68 61.59,40.41 | C3.1 40.64,65.02 35.31,59.69 34.67,59.69 33.67,58.69 33.67,58.26 32.56,57.15 32.18,57.15 31.36,56.33 31.36,55.38 32.38,54.36 IC6.23 32.38,53.09 32.38,52.32 31.37,51.31 31.37,48.26 29.84,46.74 IC6.15 29.84,44.7 29.84,38.58 | IC6.35 23.75,63.5 22.48,62.23 22.04,62.23 20.7,60.89 20.7,55.37 19.68,54.36 IC6.3 | X7.2 8.89,51.08 9.42,51.08 11.68,53.34 | R2.1 11.68,53.34 | X7.5 8.89,57.07 11.68,54.28 11.68,53.34 | IC3.16 87,38.33 86.57,37.91 86.57,29 R3.2 87.63,26.92 86.51,25.81 86.51,11.89 87.63,10.77 JP1.8 | IC8.3 74.3,59.33 72.45,57.49 69.24,57.49 68.2,58.53 68.2,64.62 69.22,65.63 IC8.16 69.22,71.12 X2.8 | QG1.8 29.84,36.2 29.84,38.58 | 29.84,38.58 36.93,38.58 39.62,41.27 C2.1 41.66,41.27 42.06,41.68 46.35,41.68 IC2.10 46.35,38.33 50.8,33.88 | VUSB_5V.1 50.8,33.88 | 61.59,40.41 59.52,38.33 55.24,38.33 50.8,33.88 | IC2.16 61.59,40.41

### Text on the board
tPlace: 6B MODE 3B | USB2Classic Adapter v1.1a / http://www.brunofreitas.com/ | /Users/bruno/Downloads/boot2 (2).bmp
bPlace: GENESIS OUT | (S)NES OUT | SATURN OUT | 3DO OUT | NEOGEO OUT